# EAGLE schematic Rough_Draft_Schematic (EAGLE 9.6.2)
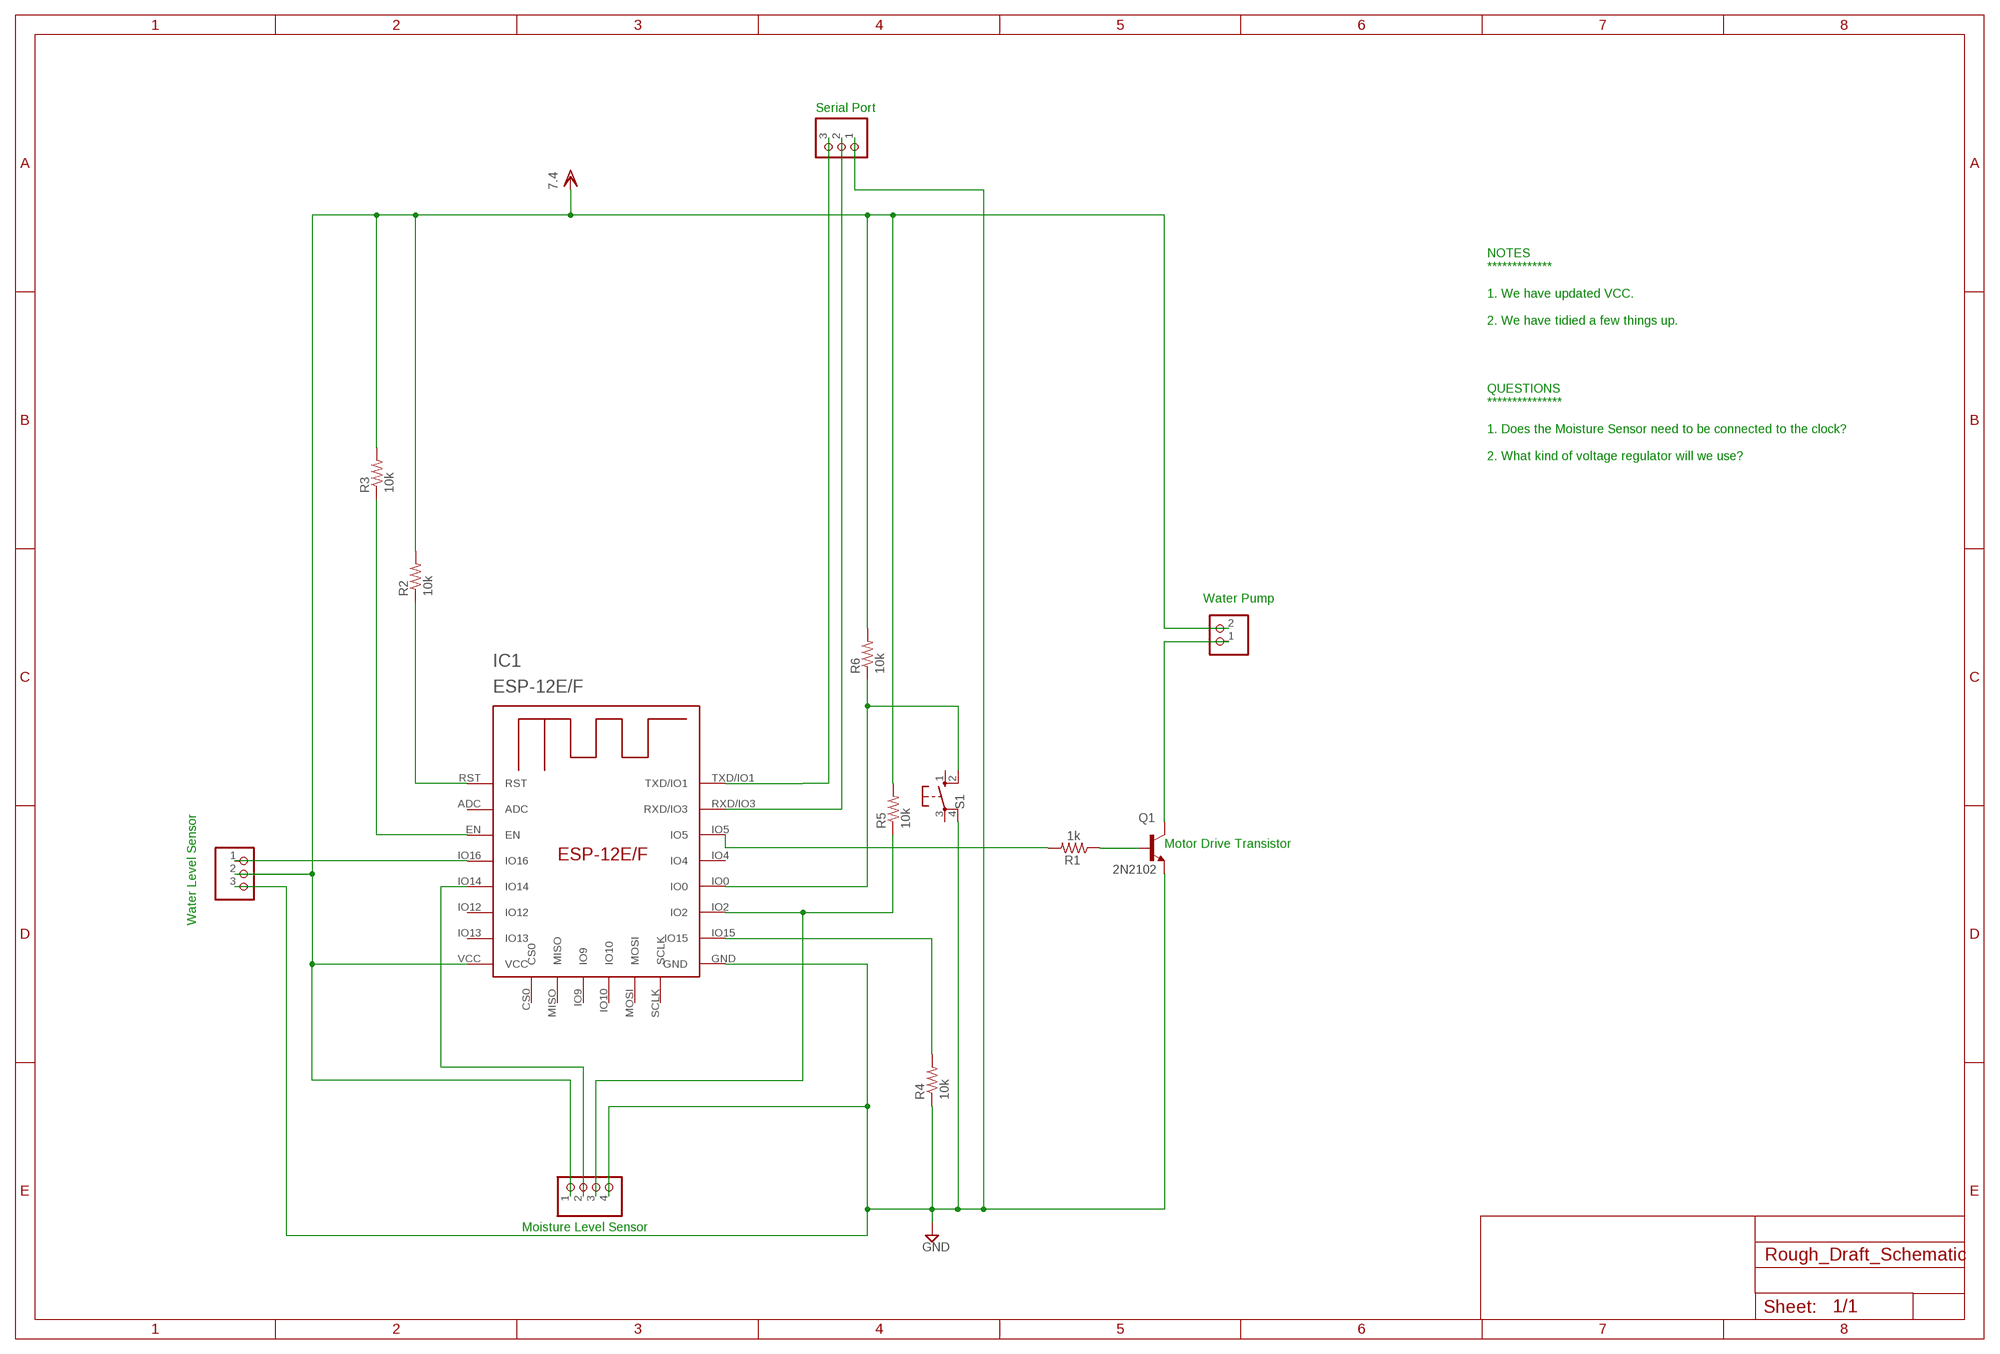
[diagram p0: schematic, sheet 1]

## Parts
IC1  ESP-12E/F  [ESP-12E]
JP1  PINHD-1X2  [1X02]
JP3  PINHD-1X3  [1X03]
JP4  PINHD-1X3  [1X03]
JP5  PINHD-1X4  [1X04]
Q1  2N2102  [TO5]
R1  1k  R-US_0204/2V  [0204V]
R2  10k  R-US_0204/2V  [0204V]
R3  10k  R-US_0204/2V  [0204V]
R4  10k  R-US_0204/2V  [0204V]
R5  10k  R-US_0204/2V  [0204V]
R6  10k  R-US_0204/2V  [0204V]
S1  10-XX  [B3F-10XX]

## Nets
GND: IC1.GND JP3.3 JP4.1 JP5.4 Q1.1(E) R4.1 S1.4(P1)
MOISTURE_SENSOR: IC1.IO2 JP5.3 R5.1
N$1: IC1.TXD/IO1
N$2: IC1.IO15 R4.2
N$3: JP4.3
N$4: IC1.RXD/IO3 JP4.2
N$5: IC1.EN R3.1
N$6: IC1.RST R2.1
N$8: IC1.IO0 R6.1 S1.2(S1)
N$10: IC1.IO14 JP5.2
N$12: IC1.IO5 R1.2
N$13: Q1.2(B) R1.1
N$14: JP1.1 Q1.3(C)
VDD: IC1.VCC JP1.2 JP3.2 JP5.1 R2.2 R3.2 R5.2 R6.2 ; supply symbol labelled 7.4
WATER_LEVEL_SENSOR: IC1.IO16 JP3.1
Unconnected: IC1.ADC IC1.CS0 IC1.IO4 IC1.IO9 IC1.IO10 IC1.IO12 IC1.IO13 IC1.MISO IC1.MOSI IC1.SCLK S1.1(S) S1.3(P)

## Notes on the sheet
- Serial Port
- NOTES
  *************
  
  1. We have updated VCC.
  
  2. We have tidied a few things up.
  
  
  
  
  QUESTIONS
  ***************
  
  1. Does the Moisture Sensor need to be connected to the clock?
  
  2. What kind of voltage regulator will we use?
- Water Pump
- Motor Drive Transistor
- Water Level Sensor
- Moisture Level Sensor

## Library data of the parts
IC1 = esp-12e-f:ESP-12E/F
JP1 = pinhead:PINHD-1X2: PIN HEADER
JP3 JP4 = pinhead:PINHD-1X3: PIN HEADER
JP5 = pinhead:PINHD-1X4: PIN HEADER
Q1 = transistor-npn:2N2102: NPN Transistor
R1-R6 = rcl:R-US_: RESISTOR, American symbol; SPICEPREFIX: R
S1 = switch-omron:10-XX: OMRON SWITCH; MPN: B3F-1000; OC_FARNELL: 176432; OC_NEWARK: 36M3542